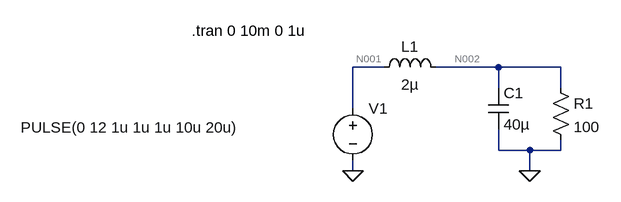
[diagram p0: schematic Draft2.asc]
Draft2.asc, the LTspice schematic file:
Version 4.1
SHEET 1 880 680
WIRE -32 16 -80 16
WIRE 144 16 48 16
WIRE 240 16 144 16
WIRE 144 48 144 16
WIRE 240 48 240 16
WIRE -80 80 -80 16
WIRE 144 144 144 112
WIRE 192 144 144 144
WIRE 240 144 240 128
WIRE 240 144 192 144
WIRE -80 176 -80 160
WIRE 192 176 192 144
FLAG 192 176 0
FLAG -80 176 0
SYMBOL voltage -80 64 R0
WINDOW 3 -511 45 Left 2
WINDOW 123 0 0 Left 0
WINDOW 39 0 0 Left 0
SYMATTR Value PULSE(0 12 1u 1u 1u 10u 20u)
SYMATTR InstName V1
SYMBOL ind -48 32 R270
WINDOW 0 32 56 VTop 2
WINDOW 3 5 56 VBottom 2
SYMATTR InstName L1
SYMATTR Value 2µ
SYMATTR SpiceLine Rser=1m
SYMBOL cap 128 48 R0
SYMATTR InstName C1
SYMATTR Value 40µ
SYMBOL res 224 32 R0
SYMATTR InstName R1
SYMATTR Value 100
TEXT -328 -40 Left 2 !.tran 0 10m 0 1u

The netlist it stands for:
* Draft2.asc
V1 N001 0 PULSE(0 12 1u 1u 1u 10u 20u)
L1 N001 N002 2µ Rser=1m
C1 N002 0 40µ
R1 N002 0 100
.tran 0 10m 0 1u
.backanno
.end

* Results of the author's LTspice run, read from the files saved beside the schematic
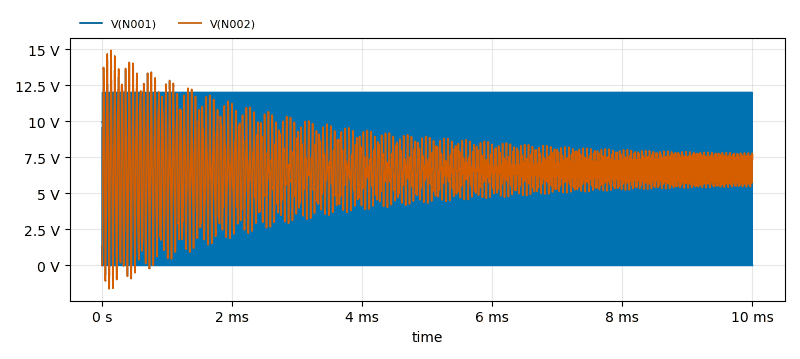
[diagram p1: Transient Analysis of Draft2.asc, plotted from the saved traces]
* Transient Analysis, 1 run:
*   V(N001): min 0 V, max 12 V, average 6.6 V, rms 8.827 V, last 0 V
*   V(N002): min -1.646 V, max 14.97 V, average 6.602 V, rms 6.941 V, last 7.34 V